# EAGLE schematic ACRoBaT - main board (EAGLE 7.2.0)
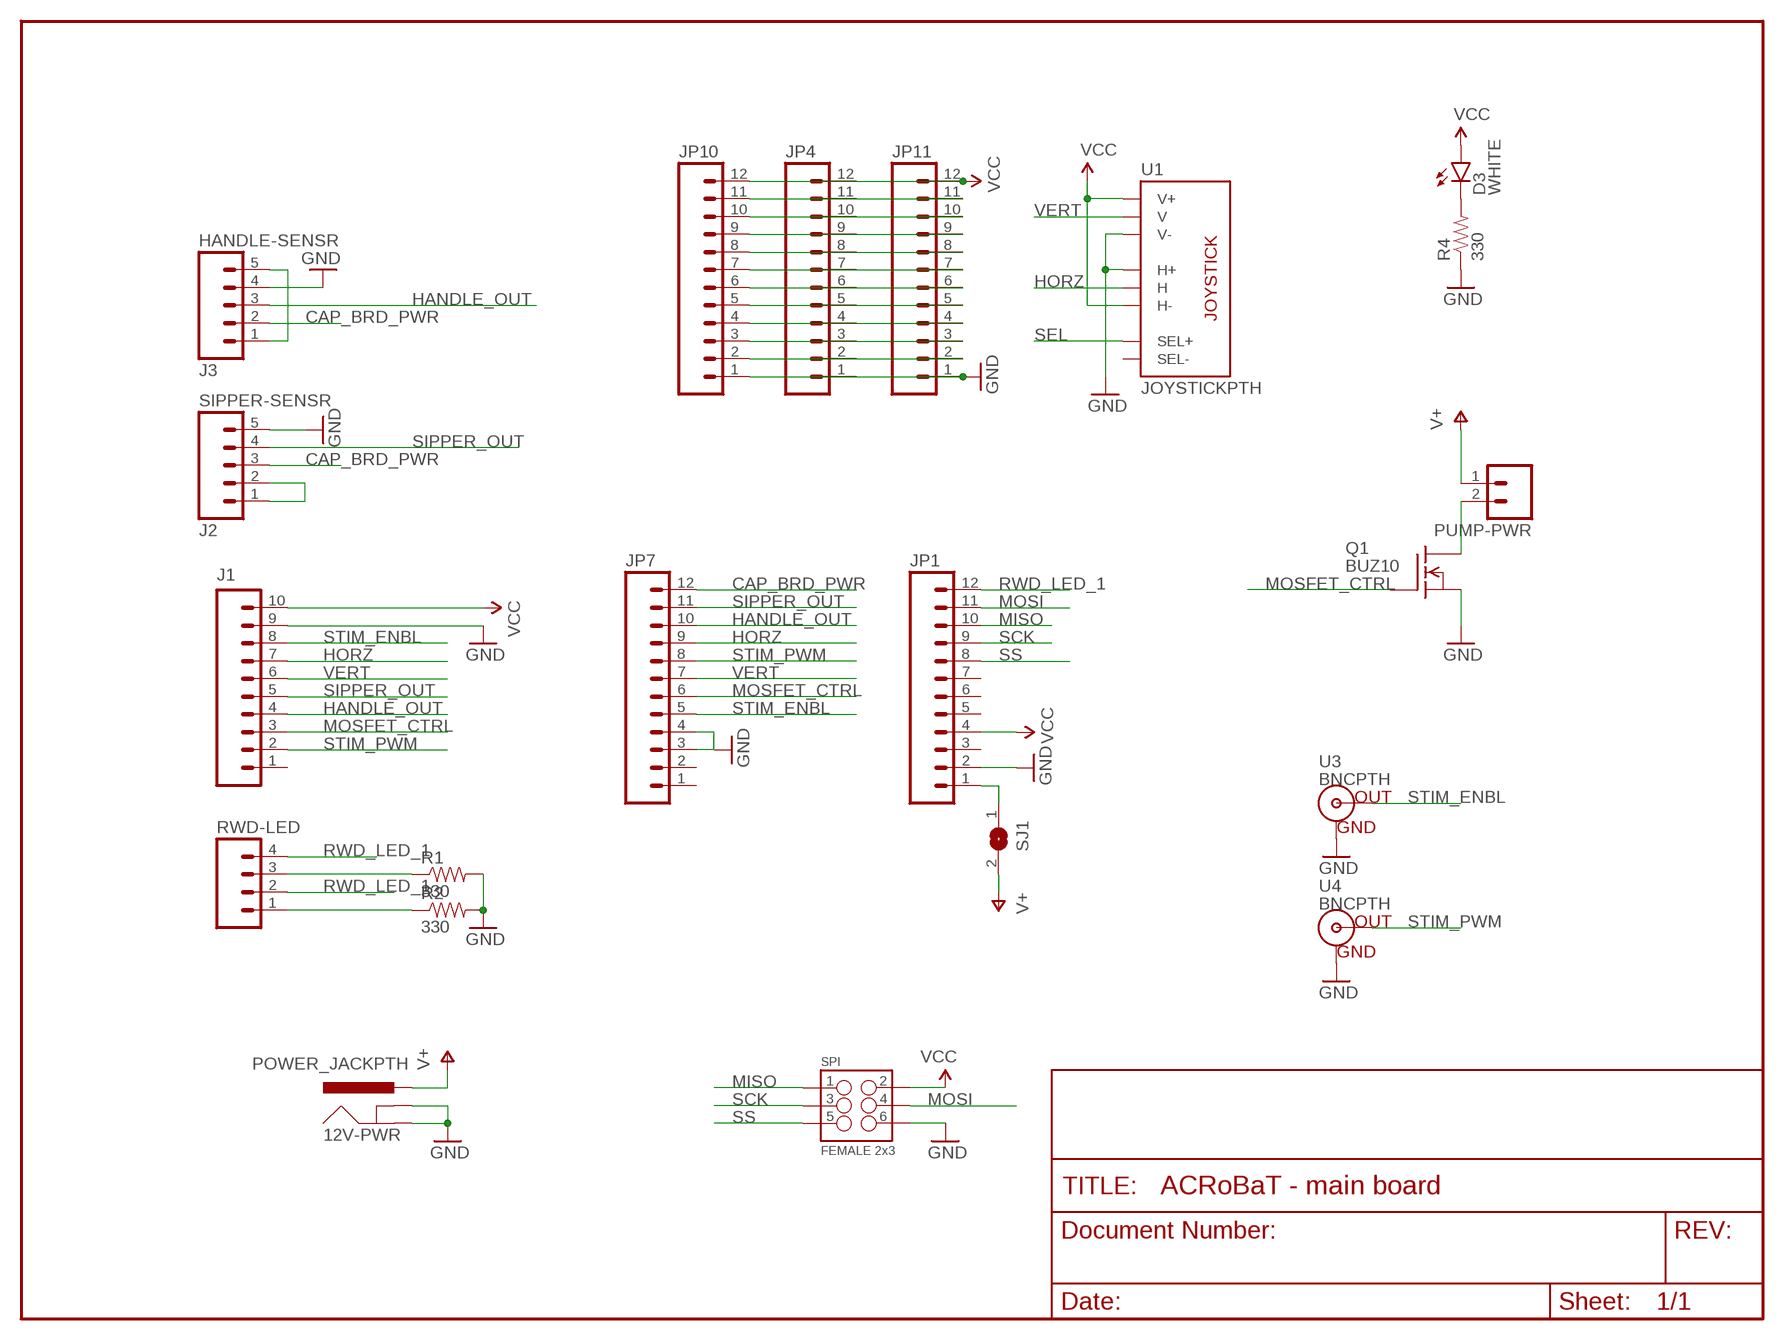
[diagram p0: schematic, sheet 1]

## Parts
12V-PWR  POWER_JACKPTH  [POWER_JACK_PTH]
D3  WHITE  LED-WHITE1206  [LED-1206]
HANDLE-SENSR  J3  M05PTH  [1X05]
J1  M10SILK_FEMALE_PTH  [1X10]
JP1  M12PTH  [1X12]
JP4  M12PTH  [1X12]
JP7  M12PTH  [1X12]
JP10  M12PTH  [1X12]
JP11  M12PTH  [1X12]
PUMP-PWR  M02PTH  [1X02]
Q1  BUZ10  [TO220]
R1  330  RESISTORAXIAL-0.3  [AXIAL-0.3]
R2  330  RESISTORAXIAL-0.3  [AXIAL-0.3]
R4  330  RESISTORAXIAL-0.3  [AXIAL-0.3]
RWD-LED  M04PTH  [1X04]
SIPPER-SENSR  J2  M05PTH  [1X05]
SJ1  SJ  [SJ]
SPI  FEMALE 2x3  M03X2FEMALE  [2X3]
U1  JOYSTICKPTH  [JOYSTICK]
U3  BNCPTH  [BNC]
U4  BNCPTH  [BNC]

## Nets
CAP_BRD_PWR: HANDLE-SENSR.2 JP7.12 SIPPER-SENSR.3
GND: 12V-PWR.GND 12V-PWR.GNDBREAK HANDLE-SENSR.4 J1.9 JP1.2 JP4.1 JP7.3 JP7.4 JP10.1 JP11.1 Q1.3(S) R1.P$2 R2.P$2 R4.P$1 SIPPER-SENSR.5 SPI.6 U1.H1(H+) U1.V3(V-) U3.GND U4.GND
HANDLE_OUT: HANDLE-SENSR.3 J1.4 JP7.10
HORZ: J1.7 JP7.9 U1.H2(H)
MISO: JP1.10 SPI.1
MOSFET_CTRL: J1.3 JP7.6 Q1.1(G)
MOSI: JP1.11 SPI.4
N$1: HANDLE-SENSR.1 HANDLE-SENSR.5
N$2: SIPPER-SENSR.1 SIPPER-SENSR.2
N$3: D3.C R4.P$2
N$5: JP4.11 JP10.11 JP11.11
N$6: R1.P$1 RWD-LED.3
N$7: R2.P$1 RWD-LED.1
N$8: JP4.10 JP10.10 JP11.10
N$9: JP4.9 JP10.9 JP11.9
N$10: JP4.8 JP10.8 JP11.8
N$11: JP4.7 JP10.7 JP11.7
N$12: JP4.6 JP10.6 JP11.6
N$13: JP4.5 JP10.5 JP11.5
N$14: JP4.4 JP10.4 JP11.4
N$15: JP4.3 JP10.3 JP11.3
N$16: JP4.2 JP10.2 JP11.2
N$21: PUMP-PWR.2 Q1.2(D)
N$33: JP1.1 SJ1.1
RWD_LED_1: JP1.12 RWD-LED.2 RWD-LED.4
SCK: JP1.9 SPI.3
SEL: U1.B1A(SEL+)
SIPPER_OUT: J1.5 JP7.11 SIPPER-SENSR.4
SS: JP1.8 SPI.5
STIM_ENBL: J1.8 JP7.5 U3.S(OUT)
STIM_PWM: J1.2 JP7.8 U4.S(OUT)
V+: 12V-PWR.PWR PUMP-PWR.1 SJ1.2
VCC: D3.A J1.10 JP1.4 JP4.12 JP10.12 JP11.12 SPI.2 U1.H3(H-) U1.V1(V+)
VERT: J1.6 JP7.7 U1.V2(V)
Unconnected: J1.1 JP1.3 JP1.5 JP1.6 JP1.7 JP7.1 JP7.2 U1.B2A(SEL-)

## Library data of the parts
12V-PWR = SparkFun-Connectors:POWER_JACK: Power Jack This is the standard 5.5mm barrel jack for power. The PTH is the most common, proven, reliable, footprint. The Slot footprint only works if the mill layer is transmitted to the PCB fab house so be warned. Mating wall wart : TOL-00298 (and others); PROD_ID: CONN-08197
D3 = SparkFun-LED:LED-WHITE: White SMD LEDs LilyPad 1206- DIO-09955; PROD_ID: DIO-09955
HANDLE-SENSR SIPPER-SENSR = SparkFun-Connectors:M05: Header 5 Standard 5-pin 0.1" header. Use with straight break away headers (SKU : PRT-00116), right angle break away headers (PRT-00553), swiss pins (PRT-00743), machine pins (PRT-00117), and female headers (PRT-00115). Molex polarized connector foot print use with SKU : PRT-08230 with associated crimp pins and housings.
J1 = SparkFun-Connectors:M10: Header 10 Standard 10-pin 0.1" header. Use with straight break away headers (SKU : PRT-00116), right angle break away headers (PRT-00553), swiss pins (PRT-00743), machine pins (PRT-00117), and female headers (PRT-00115).; PROD_ID: CONN-11563
JP1 JP4 JP7 JP10 JP11 = SparkFun-Connectors:M12: Header 12 Standard 12-pin 0.1" header. Use with straight break away headers (SKU : PRT-00116), right angle break away headers (PRT-00553), swiss pins (PRT-00743), machine pins (PRT-00117), and female headers (PRT-00115).
PUMP-PWR = SparkFun-Connectors:M02: Standard 2-pin 0.1" header. Use with - straight break away headers ( PRT-00116) - right angle break away headers (PRT-00553) - swiss pins (PRT-00743) - machine pins (PRT-00117) - female headers (PRT-00115) Molex polarized connector foot print use with: PRT-08233 with associated crimp pins and housings. 2.54_SCREWTERM for use with PRT-10571. 3.5mm Screw Terminal footprints for PRT-08084 5mm Screw Terminal footprints for use with PRT-08432
Q1 = transistor-fet:BUZ10: N-Channel Enhancement MOSFET 50V; 20A; 0,080Ohm
R1 R2 R4 = SparkFun-Passives:RESISTOR: Resistor Basic schematic elements and footprints for 0603, 1206, and PTH resistors.
RWD-LED = SparkFun-Connectors:M04: Header 4 Standard 4-pin 0.1" header. Use with straight break away headers (SKU : PRT-00116), right angle break away headers (PRT-00553), swiss pins (PRT-00743), machine pins (PRT-00117), and female headers (PRT-00115). Molex polarized connector foot print use with SKU : PRT-08231 with associated crimp pins and housings. 1MM SMD Version SKU: PRT-10208
SJ1 = jumper:SJ: SMD solder JUMPER
SPI = SparkFun-Connectors:M03X2: 2x3 .1" header. Shrouded, with keying- CONN-10681 SMT- CONN-11415 Pogo pins- HW-11044; PROD_ID: CONN-11566
U1 = SparkFun:JOYSTICK: Thumb Joystick Joystick commonly found in PS2 controllers. Two pots and a select switch. Footprint proven. Spark Fun Electronics SKU : COM-09032
U3 U4 = SparkFun-Connectors:BNC: BNC Connector, Mouser Part# 5227161